# EAGLE schematic reg (EAGLE 7.5.0)
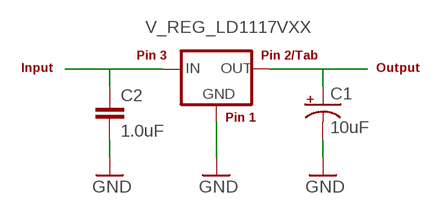
[diagram p0: schematic, sheet 1]

## Parts
C1  10uF  10UF-16V-10%(TANT)  [EIA3216]
C2  1.0uF  1.0UF-16V-10%(0603)  [0603-CAP]
U$1  V_REG_LD1117VXX  [78XXL]

## Nets
GND: C1.C(-) C2.2 U$1.IN(GND)
N$1: C2.1 U$1.OUT(IN)
N$2: C1.A(+) U$1.GND(OUT)

## Notes on the sheet
- Pin 3 | Pin 2/Tab
- Input | Output
- Pin 1

## Library data of the parts
C1 = SparkFun-Capacitors:10UF-16V-10%(TANT): CAP-00811 1206/EIA-3216 Tantalum capacitor; PROD_ID: CAP-00811
C2 = SparkFun-Capacitors:1.0UF-16V-10%(0603): CAP-00868; PROD_ID: CAP-00868
U$1 = SparkFun-PowerIC:V_REG_LD1117VXX: LD1117VXX voltage regulator. We carry the 3.3V version (COM-00526) in TO-220 package.